# EAGLE design TH Sensor (EAGLE 7.2.0)
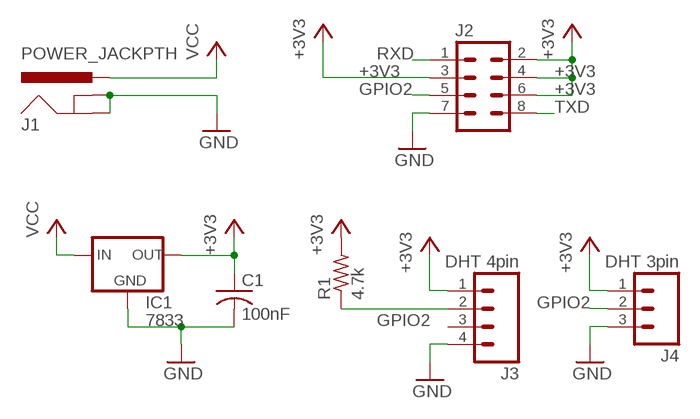
[diagram p0: schematic, sheet 1]

## Parts
C1  100nF  C-US025-025X050  [C025-025X050]
IC1  7833  78XXL  [78XXL]
J1  POWER_JACKPTH  [POWER_JACK_PTH]
J2  M04X2  [2X4]
J3  DHT 4pin  M04PTH  [1X04]
J4  DHT 3pin  M03PTH  [1X03]
R1  4.7k  R-US_0207/10  [0207/10]

## Nets
+3V3 [power]: C1.1 IC1.OUT J2.2 J2.3 J2.4 J2.6 J3.1 J4.1 R1.2
GND [power]: C1.2 IC1.GND J1.GND J1.GNDBREAK J2.7 J3.4 J4.3
GPIO2: J2.5 J3.2 J4.2 R1.1
RXD: J2.1
TXD: J2.8
VCC [power]: IC1.IN J1.PWR
Unconnected: J3.3

## Library data of the parts
C1 = rcl:C-US: CAPACITOR, American symbol
IC1 = v-reg:78XXL: VOLTAGE REGULATOR
J1 = SparkFun-Connectors:POWER_JACK: Power Jack This is the standard 5.5mm barrel jack for power. The PTH is the most common, proven, reliable, footprint. The Slot footprint only works if the mill layer is transmitted to the PCB fab house so be warned. Mating wall wart : TOL-00298 (and others); PROD_ID: CONN-08197
J2 = SparkFun-Connectors:M04X2: .1" header, two rows of four.
J3 = SparkFun-Connectors:M04: Header 4 Standard 4-pin 0.1" header. Use with straight break away headers (SKU : PRT-00116), right angle break away headers (PRT-00553), swiss pins (PRT-00743), machine pins (PRT-00117), and female headers (PRT-00115). Molex polarized connector foot print use with SKU : PRT-08231 with associated crimp pins and housings. 1MM SMD Version SKU: PRT-10208; PROD_ID: CONN-09696
J4 = SparkFun-Connectors:M03: Header 3 Standard 3-pin 0.1" header. Use with straight break away headers (SKU : PRT-00116), right angle break away headers (PRT-00553), swiss pins (PRT-00743), machine pins (PRT-00117), and female headers (PRT-00115). Molex polarized connector foot print use with SKU : PRT-08232 with associated crimp pins and housings.
R1 = rcl:R-US_: RESISTOR, American symbol

## Net classes
0 default: width 0.61 mm
1 power: width 1.27 mm

## Board
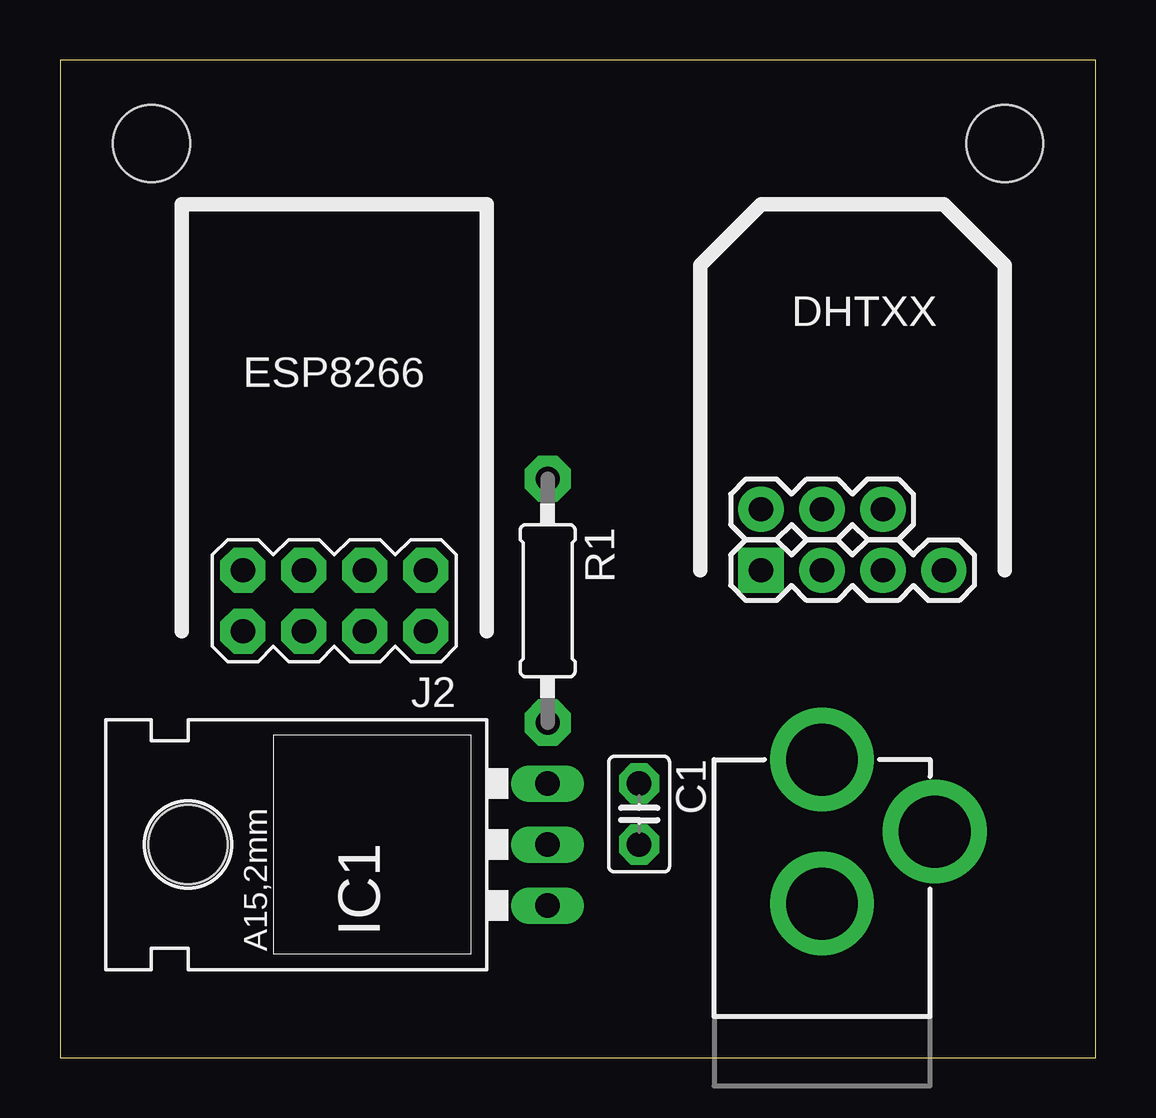
[diagram p1: board, top side]
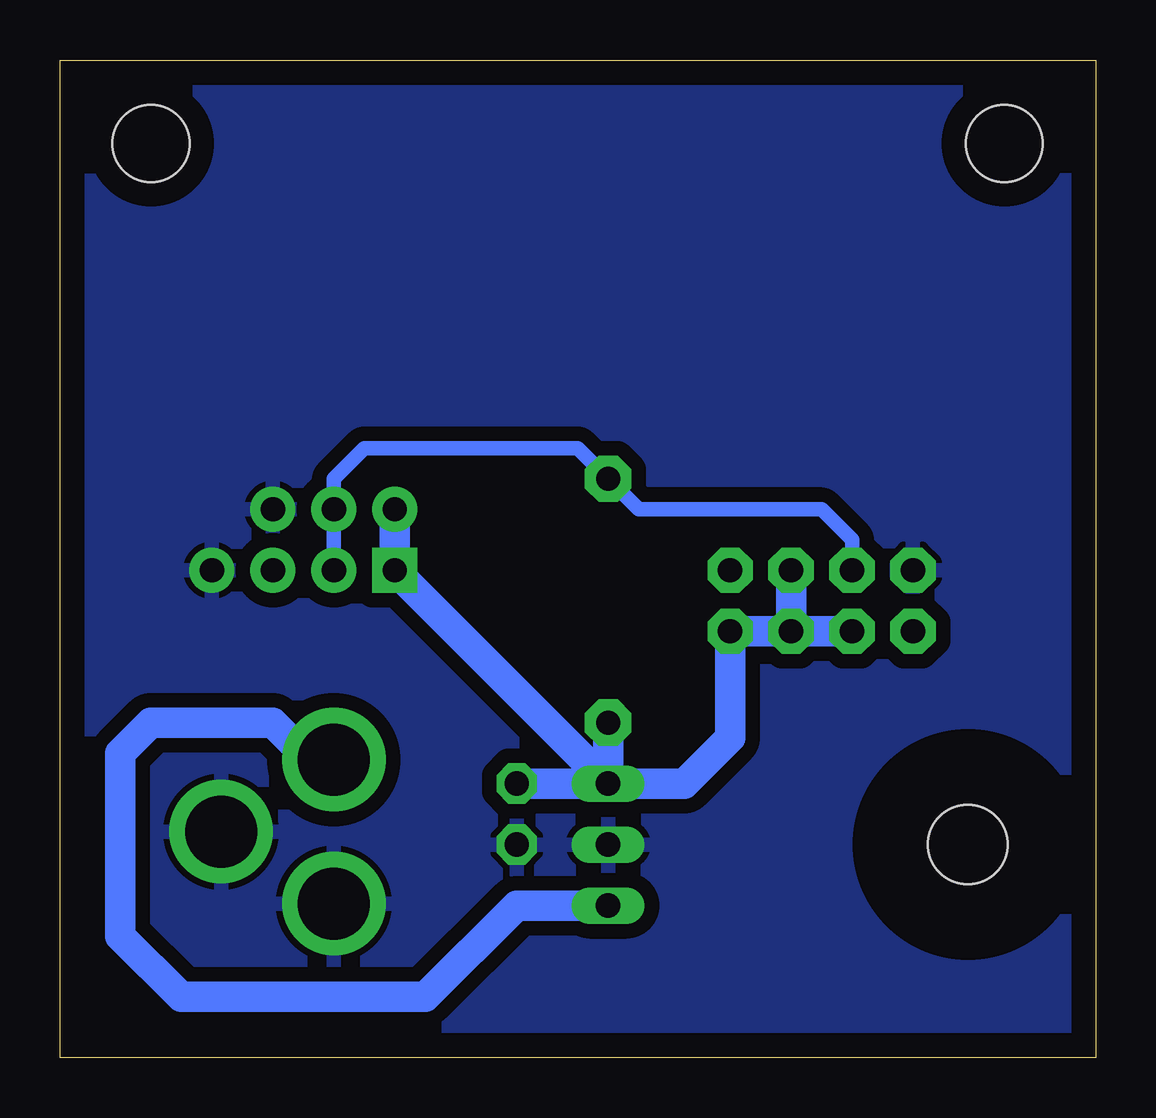
[diagram p2: board, bottom side, seen from below]

Size 43.16 x 41.58 mm. Coordinates in mm from the lower left corner, seen from the top.
Outline: 0,0 43.16,0 43.16,41.58 0,41.58 0,0
Copper layers (1*16): Top 0.035mm / dielectric 1.5mm / Bottom 0.035mm
Design rules "default": minimum track width 10mil, minimum drill 24mil, track to track 8mil, track to pad 8mil, pad to pad 8mil, via to via 8mil, smd to smd 8mil, copper to edge 40mil, drill to drill 8mil, minimum pad ring 10mil, minimum via ring 8mil, stop-mask expansion 4mil, vias tented up to drill 0mil, thermal gap 10mil
Holes 3.2 mm at 3.81,38.1 39.37,38.1

### Footprints (pad centres in the part's own frame; a part is rotated, then mirrored left to right if it is on the bottom)
C025-025X050 = drill 1.016 pad 1.676 octagon: 1 -1.27,0; 2 1.27,0
78XXL = drill 1.016 long: GND 0,-3.81; IN -2.54,-3.81; OUT 2.54,-3.81 | hole 3.302: 0,11.176
POWER_JACK_PTH = drill 2.997 pad 4.318: GND 0,7.7; GNDBREAK 4.7,10.7; PWR 0,13.7
2X4 = drill 1.016 pad 1.88 octagon: 1 -3.81,-1.27; 2 -3.81,1.27; 3 -1.27,-1.27; 4 -1.27,1.27; 5 1.27,-1.27; 6 1.27,1.27; 7 3.81,-1.27; 8 3.81,1.27
1X04 = drill 1.016 pad 1.88 square: 1 0,0 | drill 1.016 pad 1.88: 2 2.54,0; 3 5.08,0; 4 7.62,0
1X03 = drill 1.016 pad 1.88: 1 0,0; 2 2.54,0; 3 5.08,0
0207/10 = drill 1 pad 1.93 octagon: 1 -5.08,0; 2 5.08,0

### Placement (x,y rotation side)
C1  24.13,10.16 270 top
IC1  16.51,8.89 90 top
J1  31.75,-1.27 0 top
J2  11.43,19.05 180 top
J3  29.21,20.32 0 top
J4  29.21,22.86 0 top
R1  20.32,19.05 270 top

### Tracks (layer width: path | path; a pad name or v marks a point on that pad's centre or on a via)
+3V3
  Bottom 1.27: J2.6 J2.4 | J2.4 J2.2 15.24,13.34 17.14,11.43 IC1.OUT | J2.3 J2.4 | R1.2 IC1.OUT | IC1.OUT C1.1 | J4.1 J3.1 IC1.OUT
GND
  pour Bottom (isolate 0.61): 0,40.64 43.18,40.64 43.18,0 0,0
GPIO2
  Bottom 0.61: J2.5 10.16,21.59 11.43,22.86 19.05,22.86 R1.1 21.59,25.4 30.48,25.4 31.75,24.13 J4.2 J3.2
VCC
  Bottom 1.27: J1.PWR 32.75,12.43 34.29,13.97 39.37,13.97 40.64,12.7 40.64,5.08 38.1,2.54 27.94,2.54 24.13,6.35 IC1.IN

### Text on the board
tPlace: DHTXX | ESP8266